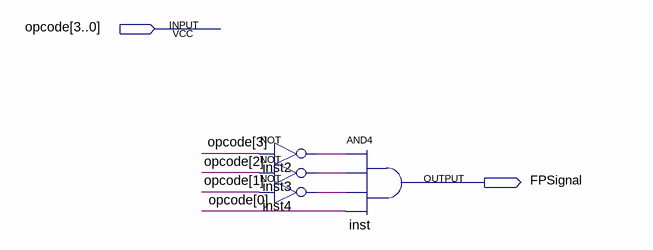
[diagram p0: schematic sheet]
// Quartus schematic FPSignal.bdf as structural Verilog: 4 symbols, 2 pins
module FPSignal (
  input  [3:0] opcode,
  output FPSignal
);

  wire inst2_out, inst3_out, inst4_out;

  not inst2 (inst2_out, opcode[3]);
  not inst3 (inst3_out, opcode[2]);
  not inst4 (inst4_out, opcode[1]);
  and inst (FPSignal, inst2_out, inst3_out, inst4_out, opcode[0]);
endmodule
